# Altium schematic sheet conn_ffc_ws22_8pin.SchDoc
size A; SheetNumber: 6
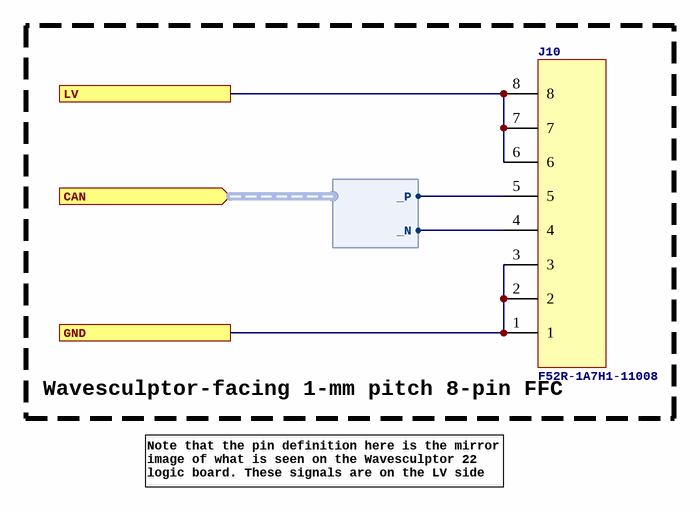
[diagram p0: conn_ffc_ws22_8pin.SchDoc]

## Parts
J10  F52R-1A7H1-11008  [AMPHENOL_F52R-1A7H1-11008]

## Blocks framed on the sheet
Wavesculptor-facing 1-mm pitch 8-pin FFC: J10

## Ports
CAN (in, harness DIFF), GND, LV

## Harnesses
DIFF: _P, _N

## Nets
GND: J10.1 J10.2 J10.3 ; port GND
LV: J10.6 J10.7 J10.8 ; port LV
NetJ10_4: J10.4 ; port CAN._N
NetJ10_5: J10.5 ; port CAN._P

## Notes on the sheet
- Note that the pin definition here is the mirror image of what is seen on the Wavesculptor 22 logic board. These signals are on the LV side of the Wavesculptor 22.

## Library data of the parts
J10 = CONN_AMPHENOL_FPC_F52R-1A7H1-11008: Conn, R/a, Ffc/fpc, 8POS, 1ROW, 1MM Rohs Compliant: Yes; Manufacturer: Amphenol Communications Solutions; Supplier 1: Digikey; Supplier Part Number 1: 609-F52R-1A7H1-11008CT-ND; Manufacturer Part Number: F52R-1A7H1-11008; Supplier 2: LCSC; Supplier Part Number 2: C3168998